# Altium schematic sheet ADCLK.SchDoc: FIT_PM12 board
size 420 x 297 mm; CheckedBy: G.Kasprowicz; Author: INR Moscow; CompanyName: WUT ISE; DrawnBy: M.Podgórski; Organization: WUT ISE; Address1: PW ISE; Address2: Nowowiejska 15/19 00-665 Warsaw; Address3: gkasprow@gmail.com; DocumentNumber: 10; Revision: 2; SheetNumber: 3; SheetTotal: 18; ModifiedBy: -; CheckedDate: -; Title2: clock distribution; DivGrp: WUT ISE; Designer: INR RAS; ModifiedDate: -; ProjectName: Sensor Box
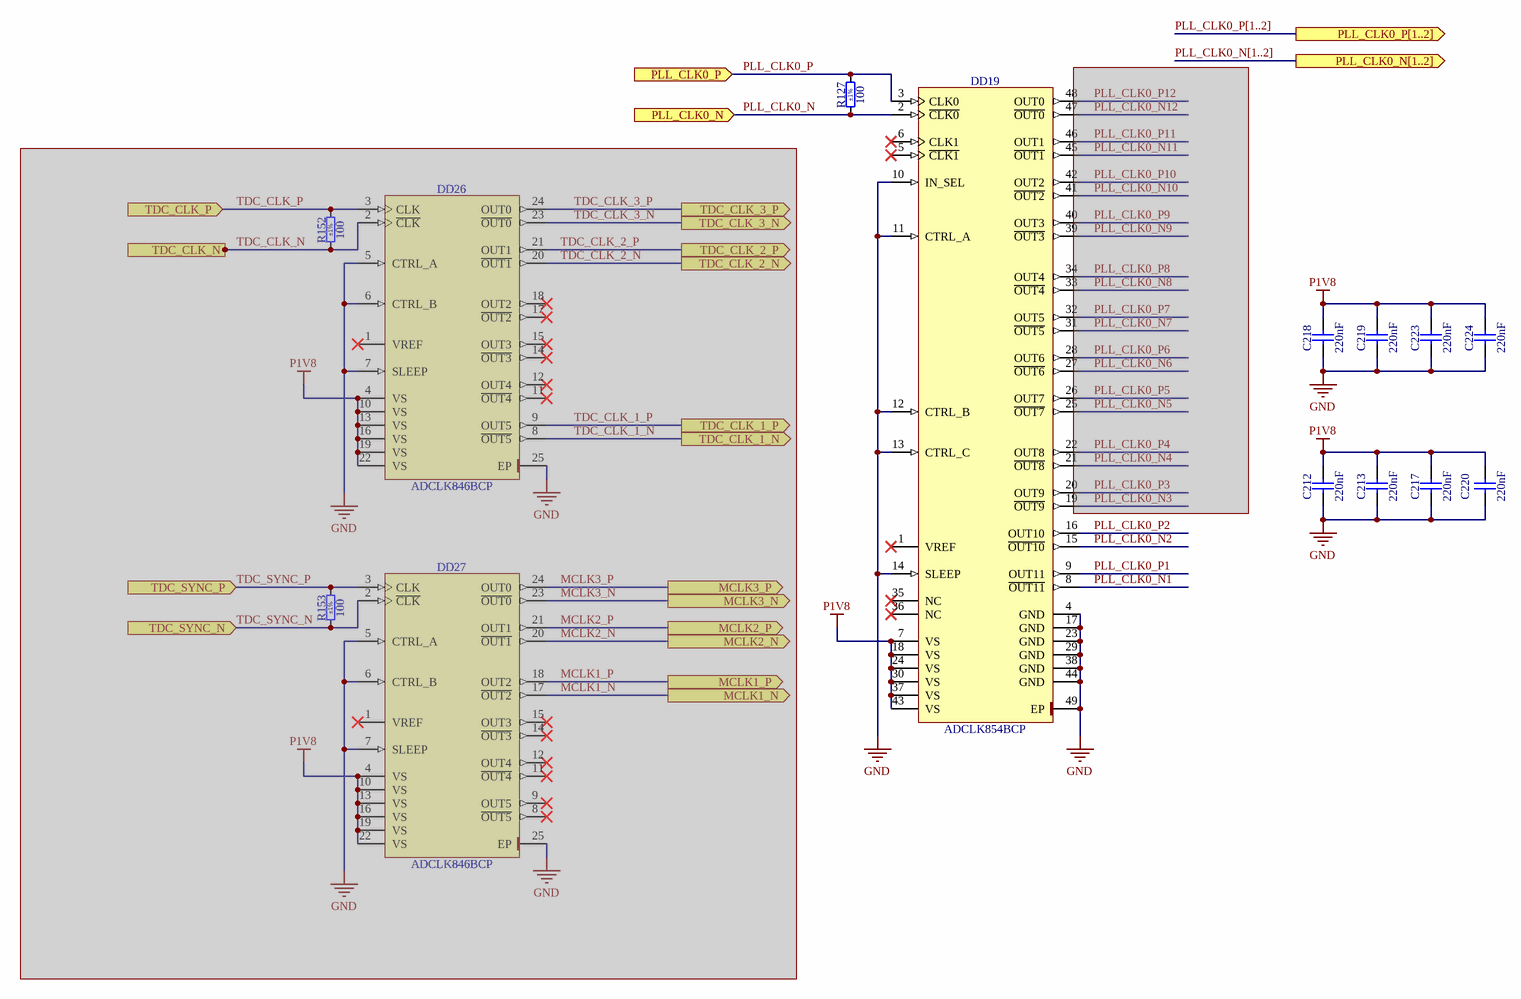
[diagram p0: ADCLK.SchDoc]

## Parts
C212  220nF  [CAPC2012X135N]
C213  220nF  [CAPC2012X135N]
C217  220nF  [CAPC2012X135N]
C218  220nF  [CAPC2012X135N]
C219  220nF  [CAPC2012X135N]
C220  220nF  [CAPC2012X135N]
C223  220nF  [CAPC2012X135N]
C224  220nF  [CAPC2012X135N]
DD19  ADCLK854BCP  [QFN50P700X700X80-49N-S290]
DD26  ADCLK846BCP  [QFN50P400X400X80-25N-S245]  (masked out: inside a compile mask, not in the netlist)
DD27  ADCLK846BCP  [QFN50P400X400X80-25N-S245]  (masked out: inside a compile mask, not in the netlist)
R127  100  Tolerance: ±1%  [RESC1608X55N]
R152  100  Tolerance: ±1%  [RESC1608X55N]  (masked out: inside a compile mask, not in the netlist)
R153  100  Tolerance: ±1%  [RESC1608X55N]  (masked out: inside a compile mask, not in the netlist)

## Ports
MCLK1_N (out), MCLK1_P (out), MCLK2_N (out), MCLK2_P (out), MCLK3_N (out), MCLK3_P (out), PLL_CLK0_N (in), PLL_CLK0_N[1..2] (out), PLL_CLK0_P (in), PLL_CLK0_P[1..2] (out), TDC_CLK_1_N (out), TDC_CLK_1_P (out), TDC_CLK_2_N (out), TDC_CLK_2_P (out), TDC_CLK_3_N (out), TDC_CLK_3_P (out), TDC_CLK_N (in), TDC_CLK_P (in), TDC_SYNC_N (in), TDC_SYNC_P (in)

## Nets
GND: C212.1 C213.1 C217.1 C218.1 C219.1 C220.1 C223.1 C224.1 DD19.4(GND) DD19.10(IN_SEL) DD19.11(CTRL_A) DD19.12(CTRL_B) DD19.13(CTRL_C) DD19.14(SLEEP) DD19.17(GND) DD19.23(GND) DD19.29(GND) DD19.38(GND) DD19.44(GND) DD19.49(EP)
P1V8: C212.2 C213.2 C217.2 C218.2 C219.2 C220.2 C223.2 C224.2 DD19.7(VS) DD19.18(VS) DD19.24(VS) DD19.30(VS) DD19.37(VS) DD19.43(VS)
PLL_CLK0_N: DD19.2(~{CLK0}) R127.1 ; port PLL_CLK0_N
PLL_CLK0_N1: DD19.8(~{OUT11})
PLL_CLK0_N2: DD19.15(~{OUT10})
PLL_CLK0_P: DD19.3(CLK0) R127.2 ; port PLL_CLK0_P
PLL_CLK0_P1: DD19.9(OUT11)
PLL_CLK0_P2: DD19.16(OUT10)

Not connected (* = marked no-connect by the designer): DD19 1(VREF)* 5(~{CLK1})* 6(CLK1)* 19(~{OUT9}) 20(OUT9) 21(~{OUT8}) 22(OUT8) 25(~{OUT7}) 26(OUT7) 27(~{OUT6}) 28(OUT6) 31(~{OUT5}) 32(OUT5) 33(~{OUT4}) 34(OUT4) 35(NC)* 36(NC)* 39(~{OUT3}) 40(OUT3) 41(~{OUT2}) 42(OUT2) 45(~{OUT1}) 46(OUT1) 47(~{OUT0}) 48(OUT0)

## Buses and harness runs
bus PLL_CLK0_N[1..2] = port PLL_CLK0_N[1..2]
bus PLL_CLK0_P[1..2] = port PLL_CLK0_P[1..2]

## Notes on the sheet
- Project/Equipment
- Document
- Designer
- Drawn by
- Check.by
- Copyright WUT ISE 2024.
  This documentation describes Open Hardware and is licensed under the CERN OHL-W v.2.0. You may redistribute and modify this documentation under the terms of the CERN OHL-W v.2.0. (http://ohwr.org/CERNOHL). This documentation is distributed WITHOUT ANY EXPRESS OR IMPLIED WARRANTY, INCLUDING OF MERCHANTABILITY, SATISFACTORY QUALITY AND FITNESS FOR A PARTICULAR PURPOSE. Please see the CERN OHL v.2.0 for applicable conditions.
- Contact
- File
- Last Mod.
- Print Date
- Sheet
- Size
- A3
- of
- Rev

## Library data of the parts
C212 C213 C217-C220 C223 C224 = CC0805_220NF_50V_10%_X7R: Non-polarised capacitor; Part Description: SMD Multilayer Chip Ceramic Capacitor; Manufacturer: GENERIC; Manufacturer1 Part Number: GRM21BR71H224KA01L; Voltage: 50V; TC: X7R; Tolerance: ±10%; Part Number: CC0805_220NF_50V_10%_X7R; Component Kind: Standard; Component Type: Standard; Pin Count: 2; Value: 220nF; Status: Preferred; Manufacturer Part Number: CC0805_220NF_50V_10%_X7R; Case: 0805; Mounted: Yes; Socket: No; SMD: Yes; Sense: No; Manufacturer1 Example: MURATA; Manufacturer1 ComponentHeight: 1.35mm; HelpURL: \\cern.ch\dfs\Applications\Altium\Datasheets\CC0805_X7R_MURATA.pdf; Author: CERN DEM JLC; CreateDate: 03.12.2007; LatestRevisionDate: 03.12.2007
DD19 = ADCLK854BCP: 1.8 V, 6 LVDS/12 CMOS Outputs Low Power Clock Fanout Buffer; Manufacturer: ANALOG DEVICES; PressFit: No; Bonding: No; Part Number: ADCLK854BCP; Component Kind: Standard; Component Type: Standard; Device: ADCLK854BCP; PackageDescription: QFN, 0.50mm Pitch, Square; 48 Pin, 7.00mm L X 7.00mm W X 0.80mm H body (w/Thermal Tab 2.9 x 2.9mm), IPC Medium Density; Part Description: 1.8 V, 6 LVDS/12 CMOS Outputs Low Power Clock Fanout Buffer; Manufacturer Part Number: ADCLK854BCP; Pin Count: 49; Case: QFN48; Mounted: Yes; Socket: No; SMD: Yes; Sense: No; ComponentHeight: 0.8mm; Author: CERN DEM HF; HelpURL: \\cern.ch\dfs\Applications\Altium\Datasheets\ADCLK854BCP.pdf; CreateDate: 24.05.2024; LatestRevisionDate: 24.05.2024
DD26 DD27 = ADCLK846BCP: 1.8 V, 6 LVDS/12 CMOS Outputs Low Power Clock Fanout Buffer; Manufacturer: ANALOG DEVICES; PressFit: No; Bonding: No; Part Number: ADCLK846BCP; Component Kind: Standard; Component Type: Standard; Device: ADCLK846BCP; PackageDescription: QFN, 0.50mm Pitch, Square; 24 Pin, 4.00mm L X 4.00mm W X 0.80mm H body (w/Thermal Tab 2.45 x 2.45mm), IPC Medium Density; Part Description: 1.8 V, 6 LVDS/12 CMOS Outputs Low Power Clock Fanout Buffer; Manufacturer Part Number: ADCLK846BCP; Pin Count: 25; Case: QFN24; Mounted: Yes; Socket: No; SMD: Yes; Sense: No; ComponentHeight: 0.8mm; Author: CERN DEM HF; HelpURL: \\cern.ch\dfs\Applications\Altium\Datasheets\ADCLK846BCP.pdf; CreateDate: 23.05.2024; LatestRevisionDate: 23.05.2024
R127 R152 R153 = R0603_100R_1%_0.1W_100PPM: Resistor - 1%; Part Description: General Purpose Thick Film Chip Resistor; Manufacturer: GENERIC; Manufacturer1 Part Number: NRC06F4700TRF; Power: 0.1W; TC: ±100ppm/°C; PressFit: No; Part Number: R0603_100R_1%_0.1W_100PPM; Component Kind: Standard; Component Type: Standard; Pin Count: 2; Value: 100; Status: Preferred; Manufacturer Part Number: R0603_100R_1%_0.1W_100PPM; Case: 0603; Mounted: Yes; Sense: No; Socket: No; SMD: Yes; Manufacturer1 Example: NIC COMPONENT; Manufacturer1 ComponentHeight: 0.55mm; HelpURL: \\cern.ch\dfs\Applications\Altium\Datasheets\R0603_NIC_NRC.pdf; Author: CERN DEM JLC; CreateDate: 03.12.2007; LatestRevisionDate: 13.03.2008